# EAGLE design Controller (EAGLE 7.7.0)
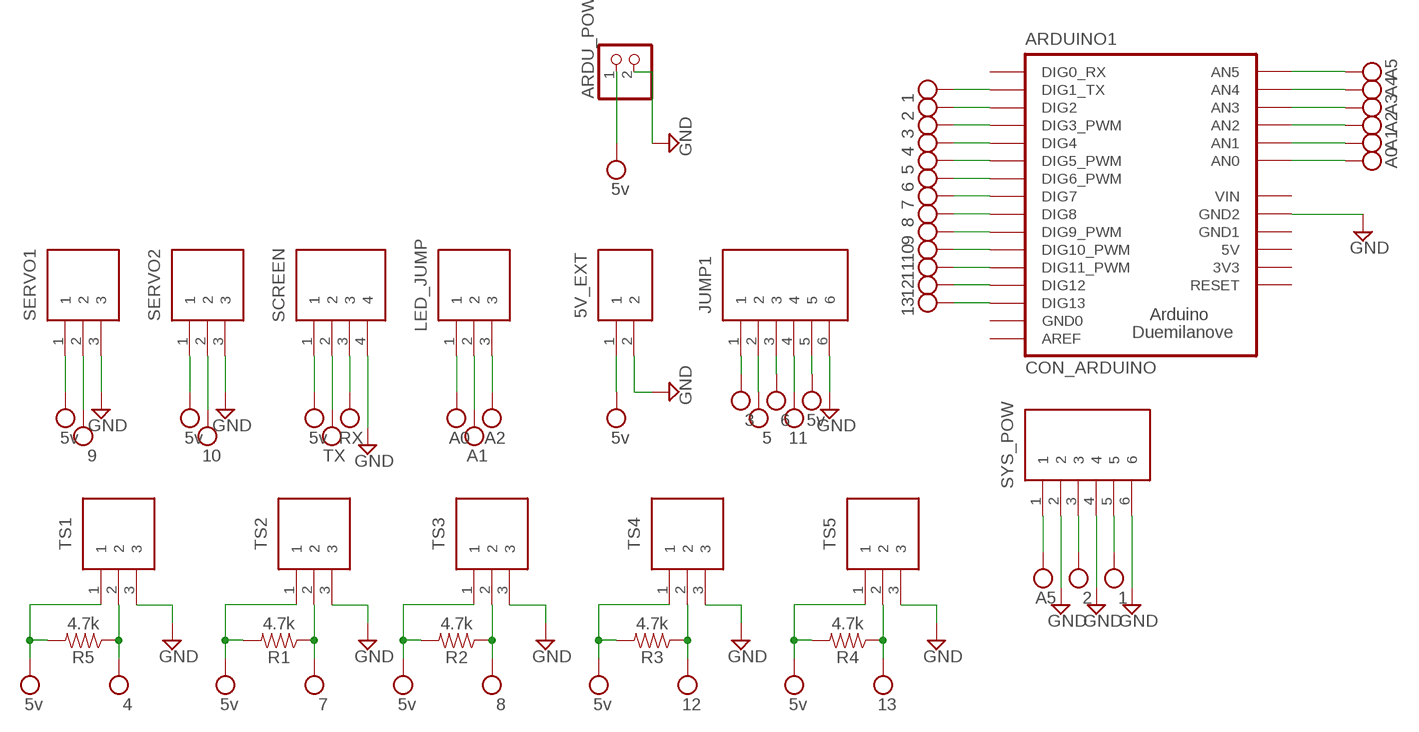
[diagram p0: schematic, sheet 1]

## Parts
5V_EXT  S2B-XH-A(LF)(SN)  [SHDR2W80P0X250_1X2_740X575X700]
ARDU_POW  PINHD-1X2  [1X02]
ARDUINO1  CON_ARDUINO  [CON_ARDUINO]
JUMP1  S6B-XH-A(LF)(SN)  [SHDR6W64P0X250_1X6_1740X1155X7]
LED_JUMP  S3B-XH-A(LF)(SN)  [SHDR3W80P0X250_1X3_990X610X700]
R1  4.7k  10KOHM-HORIZ-1/4W-5%  [AXIAL-0.3]
R2  4.7k  10KOHM-HORIZ-1/4W-5%  [AXIAL-0.3]
R3  4.7k  10KOHM-HORIZ-1/4W-5%  [AXIAL-0.3]
R4  4.7k  10KOHM-HORIZ-1/4W-5%  [AXIAL-0.3]
R5  4.7k  10KOHM-HORIZ-1/4W-5%  [AXIAL-0.3]
SCREEN  S4B-XH-A(LF)(SN)  [SHDR4W64P0X250_1X4_1240X1155X7]
SERVO1  S3B-XH-A(LF)(SN)  [SHDR3W80P0X250_1X3_990X610X700]
SERVO2  S3B-XH-A(LF)(SN)  [SHDR3W80P0X250_1X3_990X610X700]
SYS_POW  S6B-XH-A(LF)(SN)  [SHDR6W64P0X250_1X6_1740X1155X7]
TS1  S3B-XH-A(LF)(SN)  [SHDR3W80P0X250_1X3_990X610X700]
TS2  S3B-XH-A(LF)(SN)  [SHDR3W80P0X250_1X3_990X610X700]
TS3  S3B-XH-A(LF)(SN)  [SHDR3W80P0X250_1X3_990X610X700]
TS4  S3B-XH-A(LF)(SN)  [SHDR3W80P0X250_1X3_990X610X700]
TS5  S3B-XH-A(LF)(SN)  [SHDR3W80P0X250_1X3_990X610X700]

## Nets
5V_EXT: 5V_EXT.1 ARDU_POW.1 JUMP1.5 R1.P$2 R2.P$2 R3.P$2 R4.P$2 R5.P$2 SCREEN.1 SERVO1.1 SERVO2.1 TS1.1 TS2.1 TS3.1 TS4.1 TS5.1 ; supply symbol labelled 5v
GND: 5V_EXT.2 ARDU_POW.2 ARDUINO1.GND2 JUMP1.6 SCREEN.4 SERVO1.3 SERVO2.3 SYS_POW.2 SYS_POW.4 SYS_POW.6 TS1.3 TS2.3 TS3.3 TS4.3 TS5.3
PIN1: ARDUINO1.D_1(DIG1_TX) SYS_POW.5 ; supply symbol labelled 1
PIN2: ARDUINO1.D_2(DIG2) SYS_POW.3 ; supply symbol labelled 2
PIN3: ARDUINO1.D_3(DIG3_PWM) JUMP1.1 ; supply symbol labelled 3
PIN4: ARDUINO1.D_4(DIG4) R5.P$1 TS1.2 ; supply symbol labelled 4
PIN5: ARDUINO1.D_5(DIG5_PWM) JUMP1.2 ; supply symbol labelled 5
PIN6: ARDUINO1.D_6(DIG6_PWM) JUMP1.3 ; supply symbol labelled 6
PIN7: ARDUINO1.D_7(DIG7) R1.P$1 TS2.2 ; supply symbol labelled 7
PIN8: ARDUINO1.D_8(DIG8) R2.P$1 TS3.2 ; supply symbol labelled 8
PIN9: ARDUINO1.D_9(DIG9_PWM) SERVO1.2 ; supply symbol labelled 9
PIN10: ARDUINO1.D_10(DIG10_PWM) SERVO2.2 ; supply symbol labelled 10
PIN11: ARDUINO1.D_11(DIG11_PWM) JUMP1.4 ; supply symbol labelled 11
PIN12: ARDUINO1.D_12(DIG12) R3.P$1 TS4.2 ; supply symbol labelled 12
PIN13: ARDUINO1.D_13(DIG13) R4.P$1 TS5.2 ; supply symbol labelled 13
PIN_A0: ARDUINO1.A_0(AN0) LED_JUMP.1 ; supply symbol labelled A0
PIN_A1: ARDUINO1.A_1(AN1) LED_JUMP.2 ; supply symbol labelled A1
PIN_A2: ARDUINO1.A_2(AN2) LED_JUMP.3 ; supply symbol labelled A2
PIN_A3: ARDUINO1.A_3(AN3) SCREEN.2 ; supply symbol labelled A3, TX
PIN_A4: ARDUINO1.A_4(AN4) SCREEN.3 ; supply symbol labelled A4, RX
PIN_A5: ARDUINO1.A_5(AN5) SYS_POW.1 ; supply symbol labelled A5
Unconnected: ARDUINO1.3V3 ARDUINO1.5V ARDUINO1.AREF ARDUINO1.D_0(DIG0_RX) ARDUINO1.GND0 ARDUINO1.GND1 ARDUINO1.RESET

## Power pins joined to a net without a drawn wire
VIN: ARDUINO1.VIN

## Library data of the parts
5V_EXT = SamacSys_Parts:S2B-XH-A(LF)(SN): XH-2.5mm Header side entry 2 way JST XH Series, Series Number S2B, 2.5mm Pitch 2 Way 1 Row Right Angle PCB Header, Solder Termination, 3A <https://componentsearchengine.com/Images/3/S2B-XH-A%28LF%29%28SN%29.jpg> Source: Datasheet <http://www.jst-mfg.com/product/pdf/eng/eXH.pdf>; DESCRIPTION: XH-2.5mm Header side entry 2 way JST XH Series, Series Number S2B, 2.5mm Pitch 2 Way 1 Row Right Angle PCB Header, Solder Termination, 3A; HEIGHT: 7mm; MANUFACTURER_NAME: JST (JAPAN SOLDERLESS TERMINALS); MANUFACTURER_PART_NUMBER: S2B-XH-A(LF)(SN); RS_PART_NUMBER: 8201582; SUPPLIER_NAME: RS
ARDU_POW = pinhead:PINHD-1X2: PIN HEADER
ARDUINO1 = dp_devices.v6:CON_ARDUINO: Arduino board connector layout
JUMP1 SYS_POW = SamacSys_Parts:S6B-XH-A(LF)(SN): XH-2.5mm Header side entry 6 way JST XH Series, Series Number S6B, 2.5mm Pitch 6 Way 1 Row Right Angle PCB Header, Solder Termination, 3A <https://componentsearchengine.com/Images/3/S6B-XH-A%28LF%29%28SN%29.jpg> Source: Datasheet <http://www.jst-mfg.com/product/pdf/eng/eXH.pdf>; DESCRIPTION: XH-2.5mm Header side entry 6 way JST XH Series, Series Number S6B, 2.5mm Pitch 6 Way 1 Row Right Angle PCB Header, Solder Termination, 3A; HEIGHT: 7mm; MANUFACTURER_NAME: JST (JAPAN SOLDERLESS TERMINALS); MANUFACTURER_PART_NUMBER: S6B-XH-A(LF)(SN); RS_PART_NUMBER: 8201591; SUPPLIER_NAME: RS
LED_JUMP SERVO1 SERVO2 TS1-TS5 = SamacSys_Parts:S3B-XH-A(LF)(SN): XH-2.5mm Header side entry 3 way JST XH Series, Series Number S3B, 2.5mm Pitch 3 Way 1 Row Right Angle PCB Header, Solder Termination, 3A <https://componentsearchengine.com/Images/3/S3B-XH-A%28LF%29%28SN%29.jpg> Source: Datasheet <http://www.jst-mfg.com/product/pdf/eng/eXH.pdf>; DESCRIPTION: XH-2.5mm Header side entry 3 way JST XH Series, Series Number S3B, 2.5mm Pitch 3 Way 1 Row Right Angle PCB Header, Solder Termination, 3A; HEIGHT: 7mm; MANUFACTURER_NAME: JST (JAPAN SOLDERLESS TERMINALS); MANUFACTURER_PART_NUMBER: S3B-XH-A(LF)(SN); RS_PART_NUMBER: 8201585; SUPPLIER_NAME: RS
R1-R5 = SparkFun-Resistors:10KOHM: 10kΩ resistor A resistor is a passive two-terminal electrical component that implements electrical resistance as a circuit element. Resistors act to reduce current flow, and, at the same time, act to lower voltage levels within circuits. - Wikipedia; PROD_ID: RES-09435; VALUE: 10k
SCREEN = SamacSys_Parts:S4B-XH-A(LF)(SN): XH-2.5mm Header side entry 4 way JST XH Series, Series Number S4B, 2.5mm Pitch 4 Way 1 Row Right Angle PCB Header, Solder Termination, 3A <https://componentsearchengine.com/Images/3/S4B-XH-A%28LF%29%28SN%29.jpg> Source: Datasheet <http://www.jst-mfg.com/product/pdf/eng/eXH.pdf>; DESCRIPTION: XH-2.5mm Header side entry 4 way JST XH Series, Series Number S4B, 2.5mm Pitch 4 Way 1 Row Right Angle PCB Header, Solder Termination, 3A; HEIGHT: 7mm; MANUFACTURER_NAME: JST (JAPAN SOLDERLESS TERMINALS); MANUFACTURER_PART_NUMBER: S4B-XH-A(LF)(SN); RS_PART_NUMBER: 8201589; SUPPLIER_NAME: RS

## Board
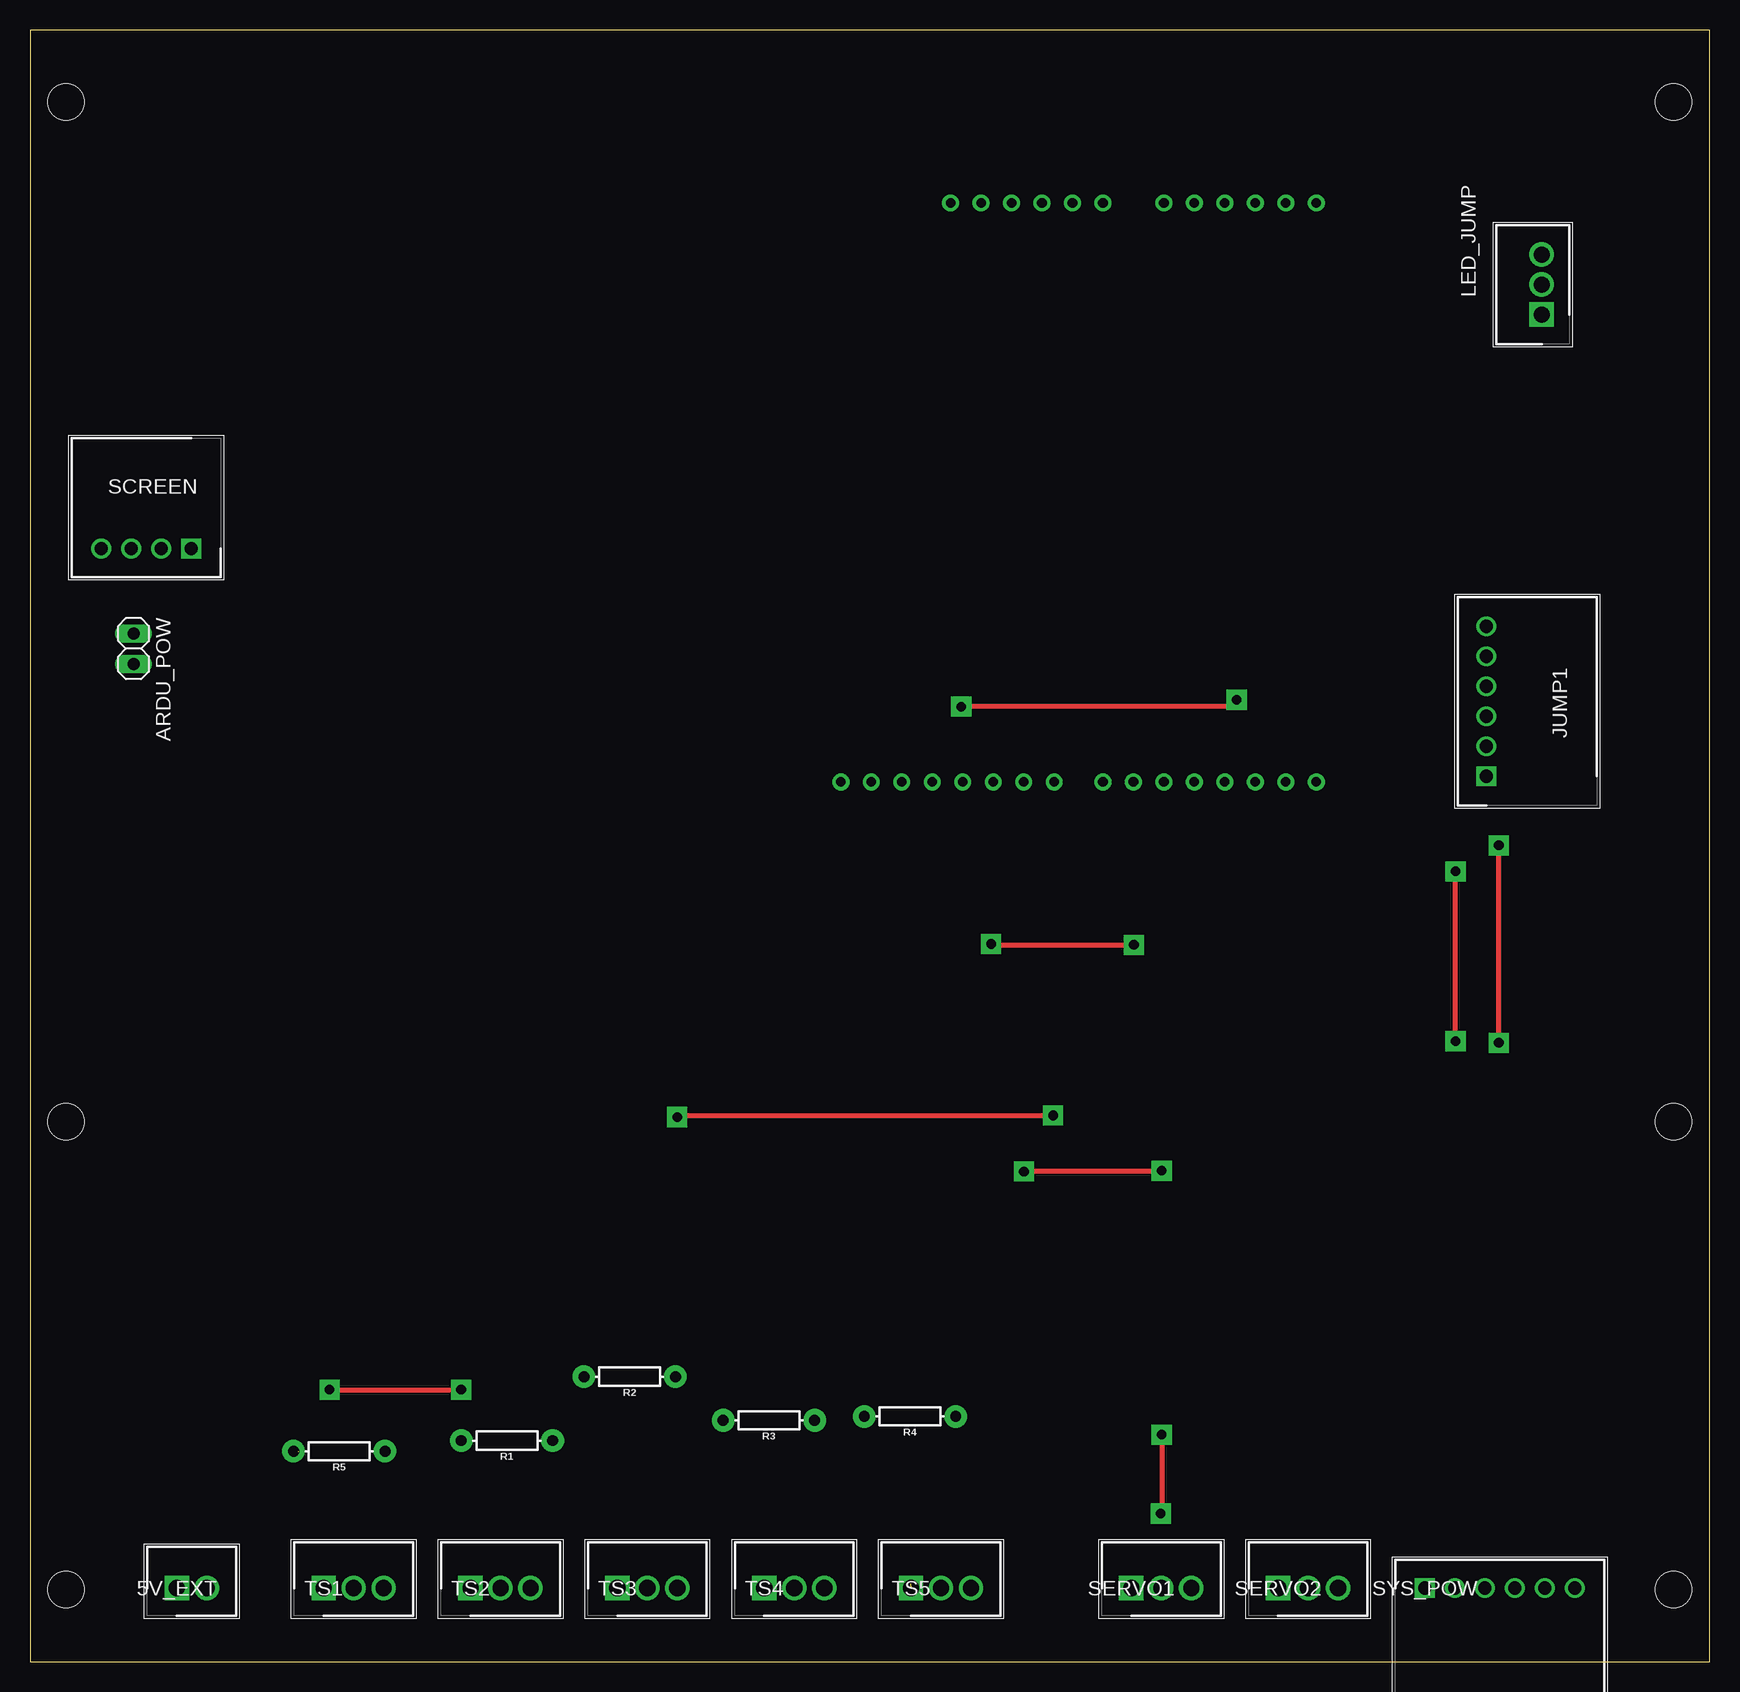
[diagram p1: board, top side]
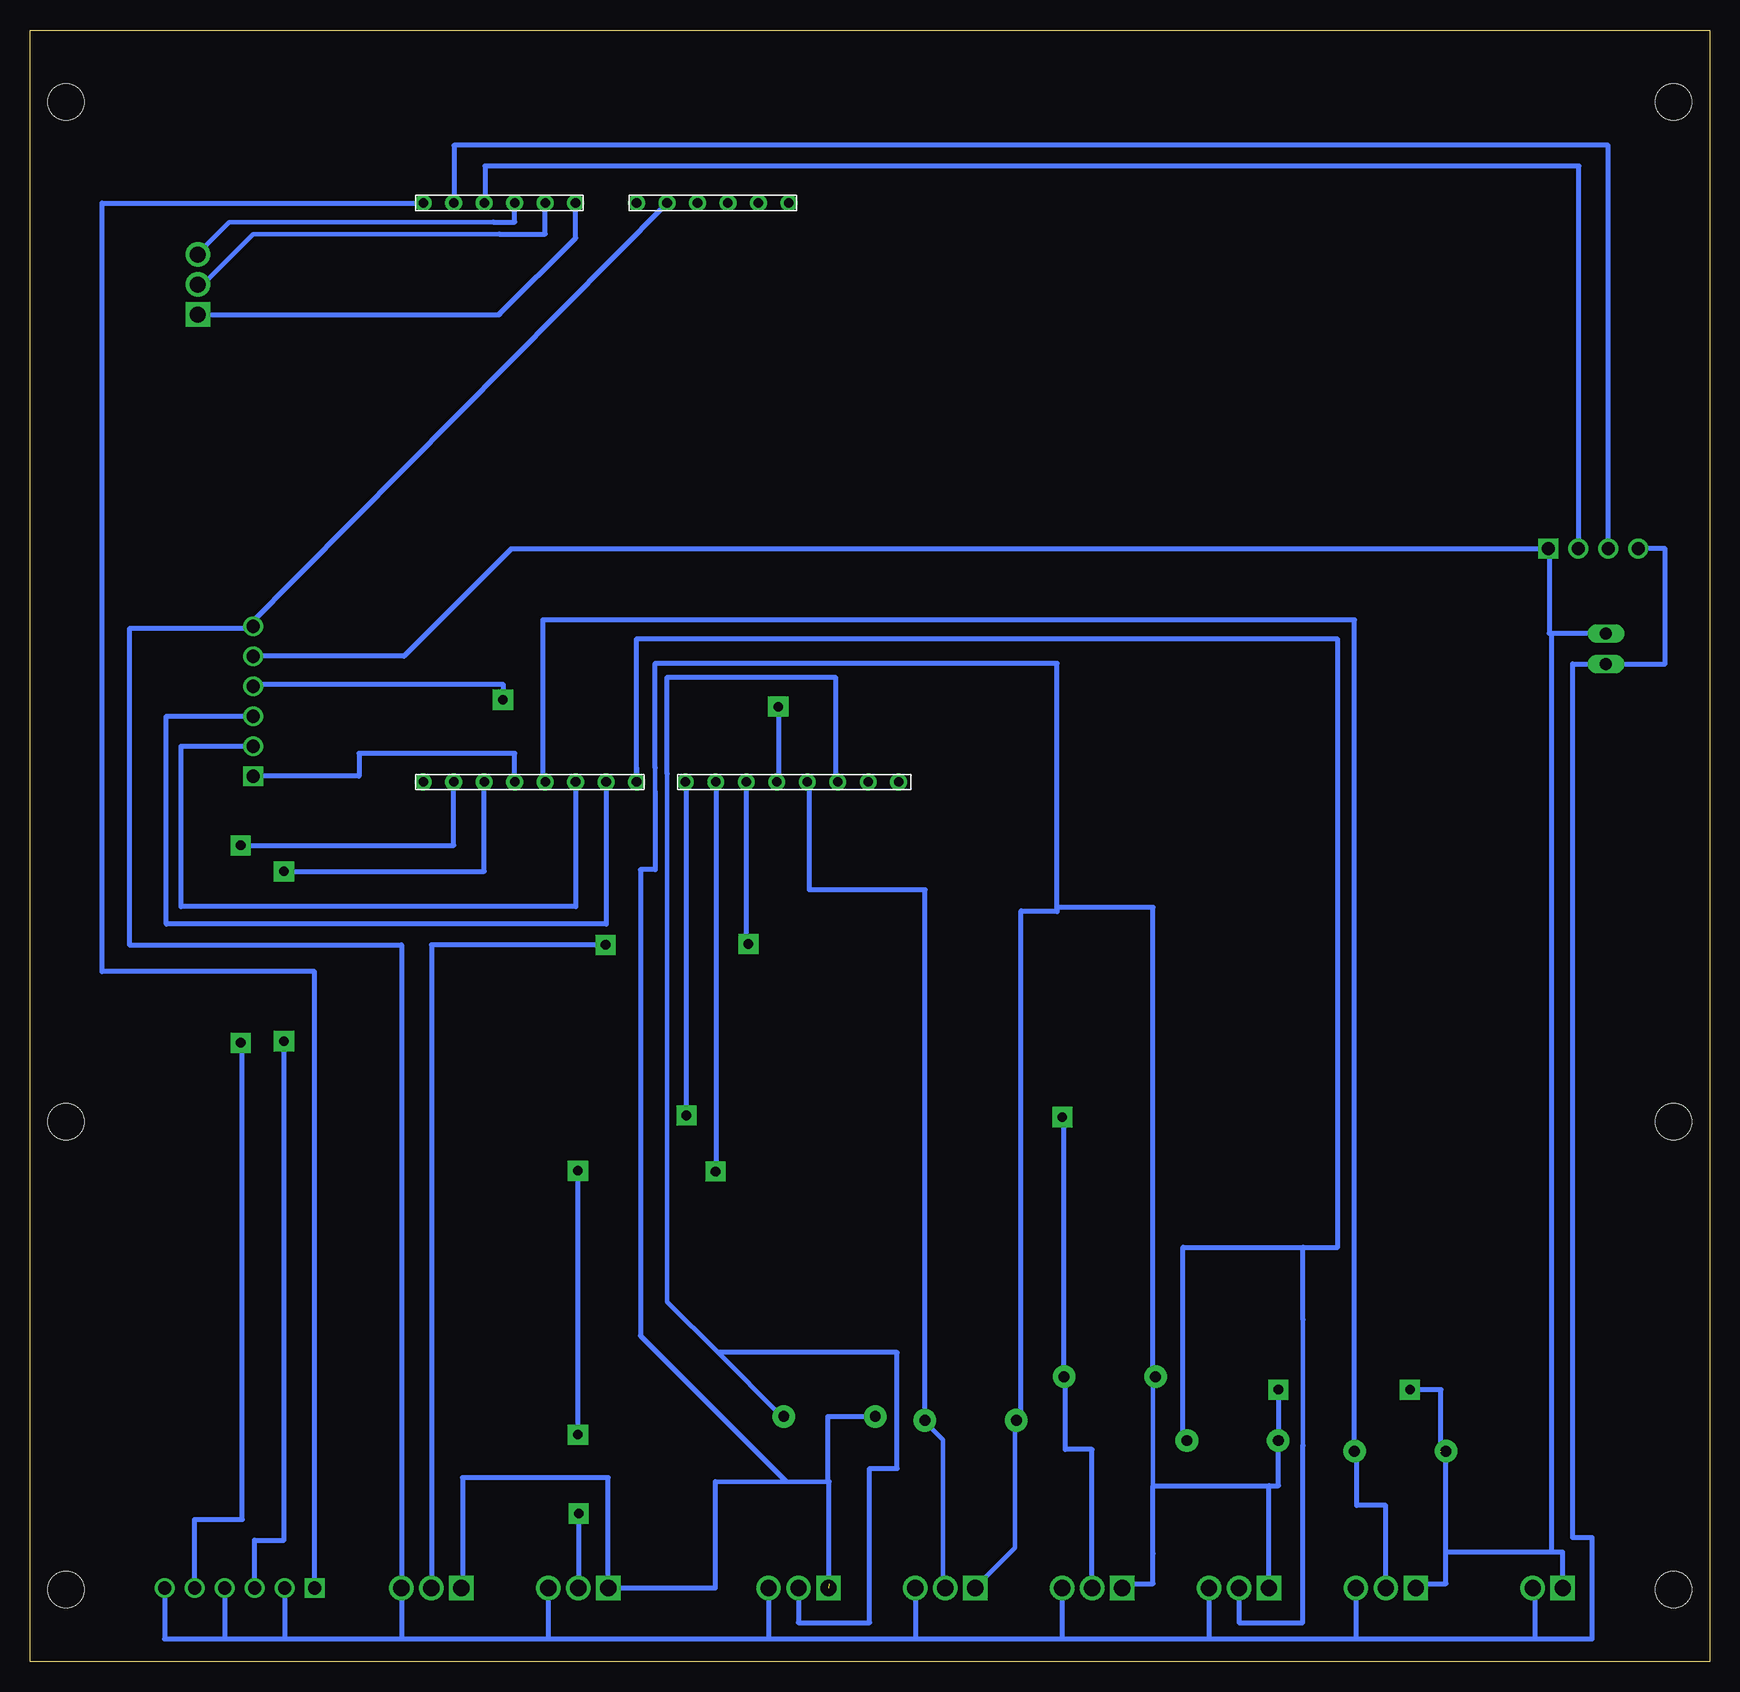
[diagram p2: board, bottom side, seen from below]

Size 140 x 136 mm. Coordinates in mm from the lower left corner, seen from the top.
Outline: 0,0 140,0 140,136 0,136 0,0
Copper layers (1*16): Top 0.035mm / dielectric 1.5mm / Bottom 0.035mm
Design rules "default *": minimum track width 15mil, minimum drill 24mil, track to track 20mil, track to pad 20mil, pad to pad 8mil, via to via 8mil, smd to smd 8mil, copper to edge 40mil, drill to drill 8mil, minimum pad ring 10mil, minimum via ring 8mil, stop-mask expansion 4mil, vias tented up to drill 0mil, thermal gap 10mil
Holes 3 mm at 3,130 137,130 3,6 137,6 3,45 137,45

### Footprints (pad centres in the part's own frame; a part is rotated, then mirrored left to right if it is on the bottom)
SHDR2W80P0X250_1X2_740X575X700 = drill 1.35 pad 2.025 square: 1 0,0 | drill 1.35 pad 2.025: 2 2.5,0
1X02 = drill 1.016 long: 1 -1.27,0; 2 1.27,0
CON_ARDUINO = drill 0.8 pad 1.4: 3V3 25.4,-12.7; 5V 25.4,-10.16; A_0 25.4,2.54; A_1 25.4,5.08; A_2 25.4,7.62; A_3 25.4,10.16; A_4 25.4,12.7; A_5 25.4,15.24; AREF -22.86,-24.384; D_0 -22.86,15.24; D_1 -22.86,12.7; D_2 -22.86,10.16; D_3 -22.86,7.62; D_4 -22.86,5.08; D_5 -22.86,2.54; D_6 -22.86,0; D_7 -22.86,-2.54; D_8 -22.86,-6.604; D_9 -22.86,-9.144; D_10 -22.86,-11.684; D_11 -22.86,-14.224; D_12 -22.86,-16.764; D_13 -22.86,-19.304; GND0 -22.86,-21.844; GND1 25.4,-7.62; GND2 25.4,-5.08; RESET 25.4,-15.24; VIN 25.4,-2.54
SHDR6W64P0X250_1X6_1740X1155X7 = drill 1.1 pad 1.65 square: 1 0,0 | drill 1.1 pad 1.65: 2 2.5,0; 3 5,0; 4 7.5,0; 5 10,0; 6 12.5,0
SHDR3W80P0X250_1X3_990X610X700 = drill 1.35 pad 2.025 square: 1 0,0 | drill 1.35 pad 2.025: 2 2.5,0; 3 5,0
AXIAL-0.3 = drill 0.9 pad 1.88: P$1 -3.81,0; P$2 3.81,0
SHDR4W64P0X250_1X4_1240X1155X7 = drill 1.1 pad 1.65 square: 1 0,0 | drill 1.1 pad 1.65: 2 2.5,0; 3 5,0; 4 7.5,0

### Placement (x,y rotation side)
5V_EXT  12.24,6.12 0 top
ARDU_POW  8.63,84.42 270 top
ARDUINO1  91.98,96.18 90 bottom
JUMP1  121.39,73.8 90 top
LED_JUMP  126.01,112.28 90 top
R1  39.75,18.41 180 top
R2  49.99,23.74 180 top
R3  61.59,20.11 180 top
R4  73.35,20.43 180 top
R5  25.78,17.52 180 top
SCREEN  13.44,92.76 180 top
SERVO1  91.8,6.12 0 top
SERVO2  104.04,6.12 0 top
SYS_POW  116.28,6.12 0 top
TS1  24.48,6.12 0 top
TS2  36.72,6.12 0 top
TS3  48.96,6.12 0 top
TS4  61.2,6.12 0 top
TS5  73.44,6.12 0 top

### Tracks (layer width: path | path; a pad name or v marks a point on that pad's centre or on a via)
5V_EXT  (via drill 0.8 pad 1.68)  (2 unrouted)
  Top 0.406: v24.97,22.66 v35.94,22.66
  Bottom 0.381: 13.88,92.5 SCREEN.1 | 24.38,6.5 TS1.1 | TS4.1 60.88,6.5 57.88,9.5 57.88,20 R3.P$2 57.38,20.5 | 36.38,6.5 TS2.1 | 46.38,9 46.38,23.5 R2.P$2 46.38,24 | 48.88,6.5 TS3.1 | 82.88,15 76.98,15 73.48,15 | 87.88,72.5 87.88,74.5
  Bottom 0.406: 87.88,74.5 87.88,83.2 54.38,83.2 54.38,62.86 | 22.38,17.5 22.38,17.48 | 24.5,6.12 TS1.1 | 87.88,72.5 87.88,66.01 89.11,66.01 89.11,27.16 76.98,15.03 76.98,15 | 82.88,15 82.88,6.12 SERVO1.1 91.8,15.32 103.96,15.32 103.96,6.12 SERVO2.1 | 54.38,62.5 54.38,62.57 | 54.38,62.57 54.38,62.86 | 46.38,24 46.38,62.86 54.38,62.86 | 57.38,20.5 57.38,62.57 54.38,62.57 | 73.38,6.5 73.38,15 73.48,15 73.48,20.43 R4.P$2 | 48.88,6.5 46.38,6.5 46.38,9 46.38,14.65 36.72,14.65 | ARDU_POW.1 13.21,85.69 | 13.21,85.69 13.37,85.69 13.37,92.77 SCREEN.1 99.86,92.77 108.83,83.8 JUMP1.5 | v24.97,22.66 22.38,22.66 22.38,17.52 R5.P$2 21.97,9.12 | v35.94,22.66 R1.P$2 | TS2.1 36.72,14.65 | 36.72,14.65 35.94,14.65 R1.P$2 | R1.P$2 | 24.38,6.5 21.97,6.5 21.97,9.12 | 13.21,85.69 13.21,9.12 | 13.21,9.12 21.97,9.12 | 5V_EXT.1 12.24,9.12 13.21,9.12
GND
  Bottom 0.406: SCREEN.4 3.7,92.77 3.7,83.15 ARDU_POW.2 11.41,83.15 11.41,10.31 9.77,10.31 9.77,1.88 14.58,1.88 | JUMP1.6 121.39,86.22 121.91,86.22 | ARDUINO1.GND2 121.91,86.22 | TS3.3 53.96,1.88 | 53.96,1.88 41.72,1.88 | 41.72,1.88 29.48,1.88 | 29.48,1.88 14.58,1.88 | TS1.3 29.48,1.88 | TS2.3 41.72,1.88 | 109.04,1.88 SERVO2.3 109.04,59.74 131.72,59.74 131.72,86.09 121.91,86.09 121.91,86.22 | 109.04,1.88 96.8,1.88 | 96.8,1.88 78.44,1.88 | 78.44,1.88 66.2,1.88 | 66.2,1.88 53.96,1.88 | SERVO1.3 96.8,1.88 | TS5.3 78.44,1.88 | TS4.3 66.2,1.88 | SYS_POW.6 128.78,1.88 123.78,1.88 | 123.78,1.88 118.78,1.88 | 118.78,1.88 109.04,1.88 | SYS_POW.4 123.78,1.88 | SYS_POW.2 118.78,1.88 | 5V_EXT.2 14.58,6.12 14.58,1.88
PIN1  (via drill 0.8 pad 1.68)
  Top 0.406: v122.44,51.57 v122.44,68.04
  Bottom 0.406: SYS_POW.5 126.28,11.85 122.3,11.85 122.3,51.57 v122.44,51.57 | v122.44,68.04 104.68,68.04 ARDUINO1.D_1
PIN2  (via drill 0.8 pad 1.68)
  Top 0.406: v118.83,51.71 v118.83,65.87
  Bottom 0.406: SYS_POW.3 121.28,10.11 118.83,10.11 v118.83,51.71 | v118.83,65.87 102.14,65.87 ARDUINO1.D_2
PIN3
  Bottom 0.406: ARDUINO1.D_3 99.6,75.69 112.57,75.69 112.57,73.8 JUMP1.1
PIN4
  Bottom 0.406: TS1.2 26.98,13 29.4,13 29.4,17.52 R5.P$1 29.59,86.81 97.26,86.81 97.26,73.32 ARDUINO1.D_4
PIN5
  Bottom 0.406: ARDUINO1.D_5 94.52,62.92 127.42,62.92 127.42,76.3 JUMP1.2
PIN6
  Bottom 0.406: ARDUINO1.D_6 91.98,61.48 128.64,61.48 128.64,78.8 JUMP1.3
PIN7
  Bottom 0.381: 89.38,74.5 89.38,73.5 ARDUINO1.D_7 | 43.88,18.5 R1.P$1 | 33.88,28.5 33.88,18
  Bottom 0.406: 43.88,18.5 43.88,34.52 33.88,34.52 | 33.88,34.52 30.99,34.52 30.99,85.22 89.46,85.22 89.46,73.32 ARDUINO1.D_7 | 33.88,28.5 33.88,34.52 | TS2.2 39.22,3.25 33.92,3.25 33.92,18 33.88,18
PIN8  (via drill 0.8 pad 1.68)
  Top 0.406: v53.95,45.38 53.95,45.52 v85.28,45.52
  Bottom 0.381: 53.38,23.5 R2.P$1
  Bottom 0.406: v53.95,45.38 53.8,45.38 R2.P$1 53.71,23.74 53.71,17.68 51.46,17.68 TS3.2 | v85.28,45.52 85.28,73.32 ARDUINO1.D_8
PIN9  (via drill 0.8 pad 1.68)
  Top 0.406: v82.86,40.84 82.86,40.91 v94.33,40.91 94.41,40.91 | v94.33,18.9 94.33,12.34 v94.26,12.34
  Bottom 0.406: ARDUINO1.D_9 82.83,40.84 v82.86,40.84 | v94.33,40.91 v94.33,18.9 | v94.26,12.34 94.26,6.12 SERVO1.2
PIN10  (via drill 0.8 pad 1.68)
  Top 0.406: v80.11,59.81 80.11,59.74 v92.02,59.74
  Bottom 0.406: ARDUINO1.D_10 80.29,59.81 v80.11,59.81 | v92.02,59.74 106.54,59.74 SERVO2.2
PIN11  (via drill 0.8 pad 1.68)
  Top 0.406: v100.58,80.17 100.58,79.59 v77.62,79.59
  Bottom 0.406: JUMP1.4 121.39,81.47 100.58,81.47 v100.58,80.17 | v77.62,79.59 77.62,73.32 ARDUINO1.D_11
PIN12
  Bottom 0.381: 65.38,20.5 R3.P$1 65.38,20 63.88,18.5 63.88,6.5 TS4.2
  Bottom 0.406: 65.38,20.5 65.38,64.31 75.03,64.31 75.03,73.32 ARDUINO1.D_12
PIN13
  Bottom 0.381: 86.88,74 86.88,30 82.64,25.76 77.38,20.5 R4.P$1 76.88,20.5
  Bottom 0.406: 86.88,74 86.88,82.05 72.86,82.05 72.86,73.32 ARDUINO1.D_13 | TS5.2 75.94,3.25 70.02,3.25 70.02,16.09 67.71,16.09 67.71,25.76 82.64,25.76
PIN_A0
  Bottom 0.406: LED_JUMP.1 100.83,112.28 100.83,112.34 94.52,118.66 ARDUINO1.A_0
PIN_A1
  Bottom 0.381: 100.88,119 121.38,119 125.88,114.5 LED_JUMP.2
  Bottom 0.406: 100.88,119 97.06,119 ARDUINO1.A_1
PIN_A2
  Bottom 0.381: 101.38,120 123.38,120 125.88,117.5 LED_JUMP.3
  Bottom 0.406: 101.38,120 99.6,120 ARDUINO1.A_2
PIN_A3
  Bottom 0.381: 10.88,93 SCREEN.2
  Bottom 0.406: 10.88,93 10.88,124.66 102.07,124.66 102.07,122.06 102.36,122.06 102.36,121.58 ARDUINO1.A_3
PIN_A4
  Bottom 0.406: SCREEN.3 8.44,126.39 104.67,126.39 104.67,121.58 ARDUINO1.A_4
PIN_A5
  Bottom 0.406: SYS_POW.1 116.28,57.51 133.98,57.51 133.98,121.58 ARDUINO1.A_5